# Altium schematic sheet ltk-mw-tx.SchDoc: MW Bench - Transmitter
size A3; DocumentNumber: 3; Revision: 3.0; SheetNumber: 3; SheetTotal: 3
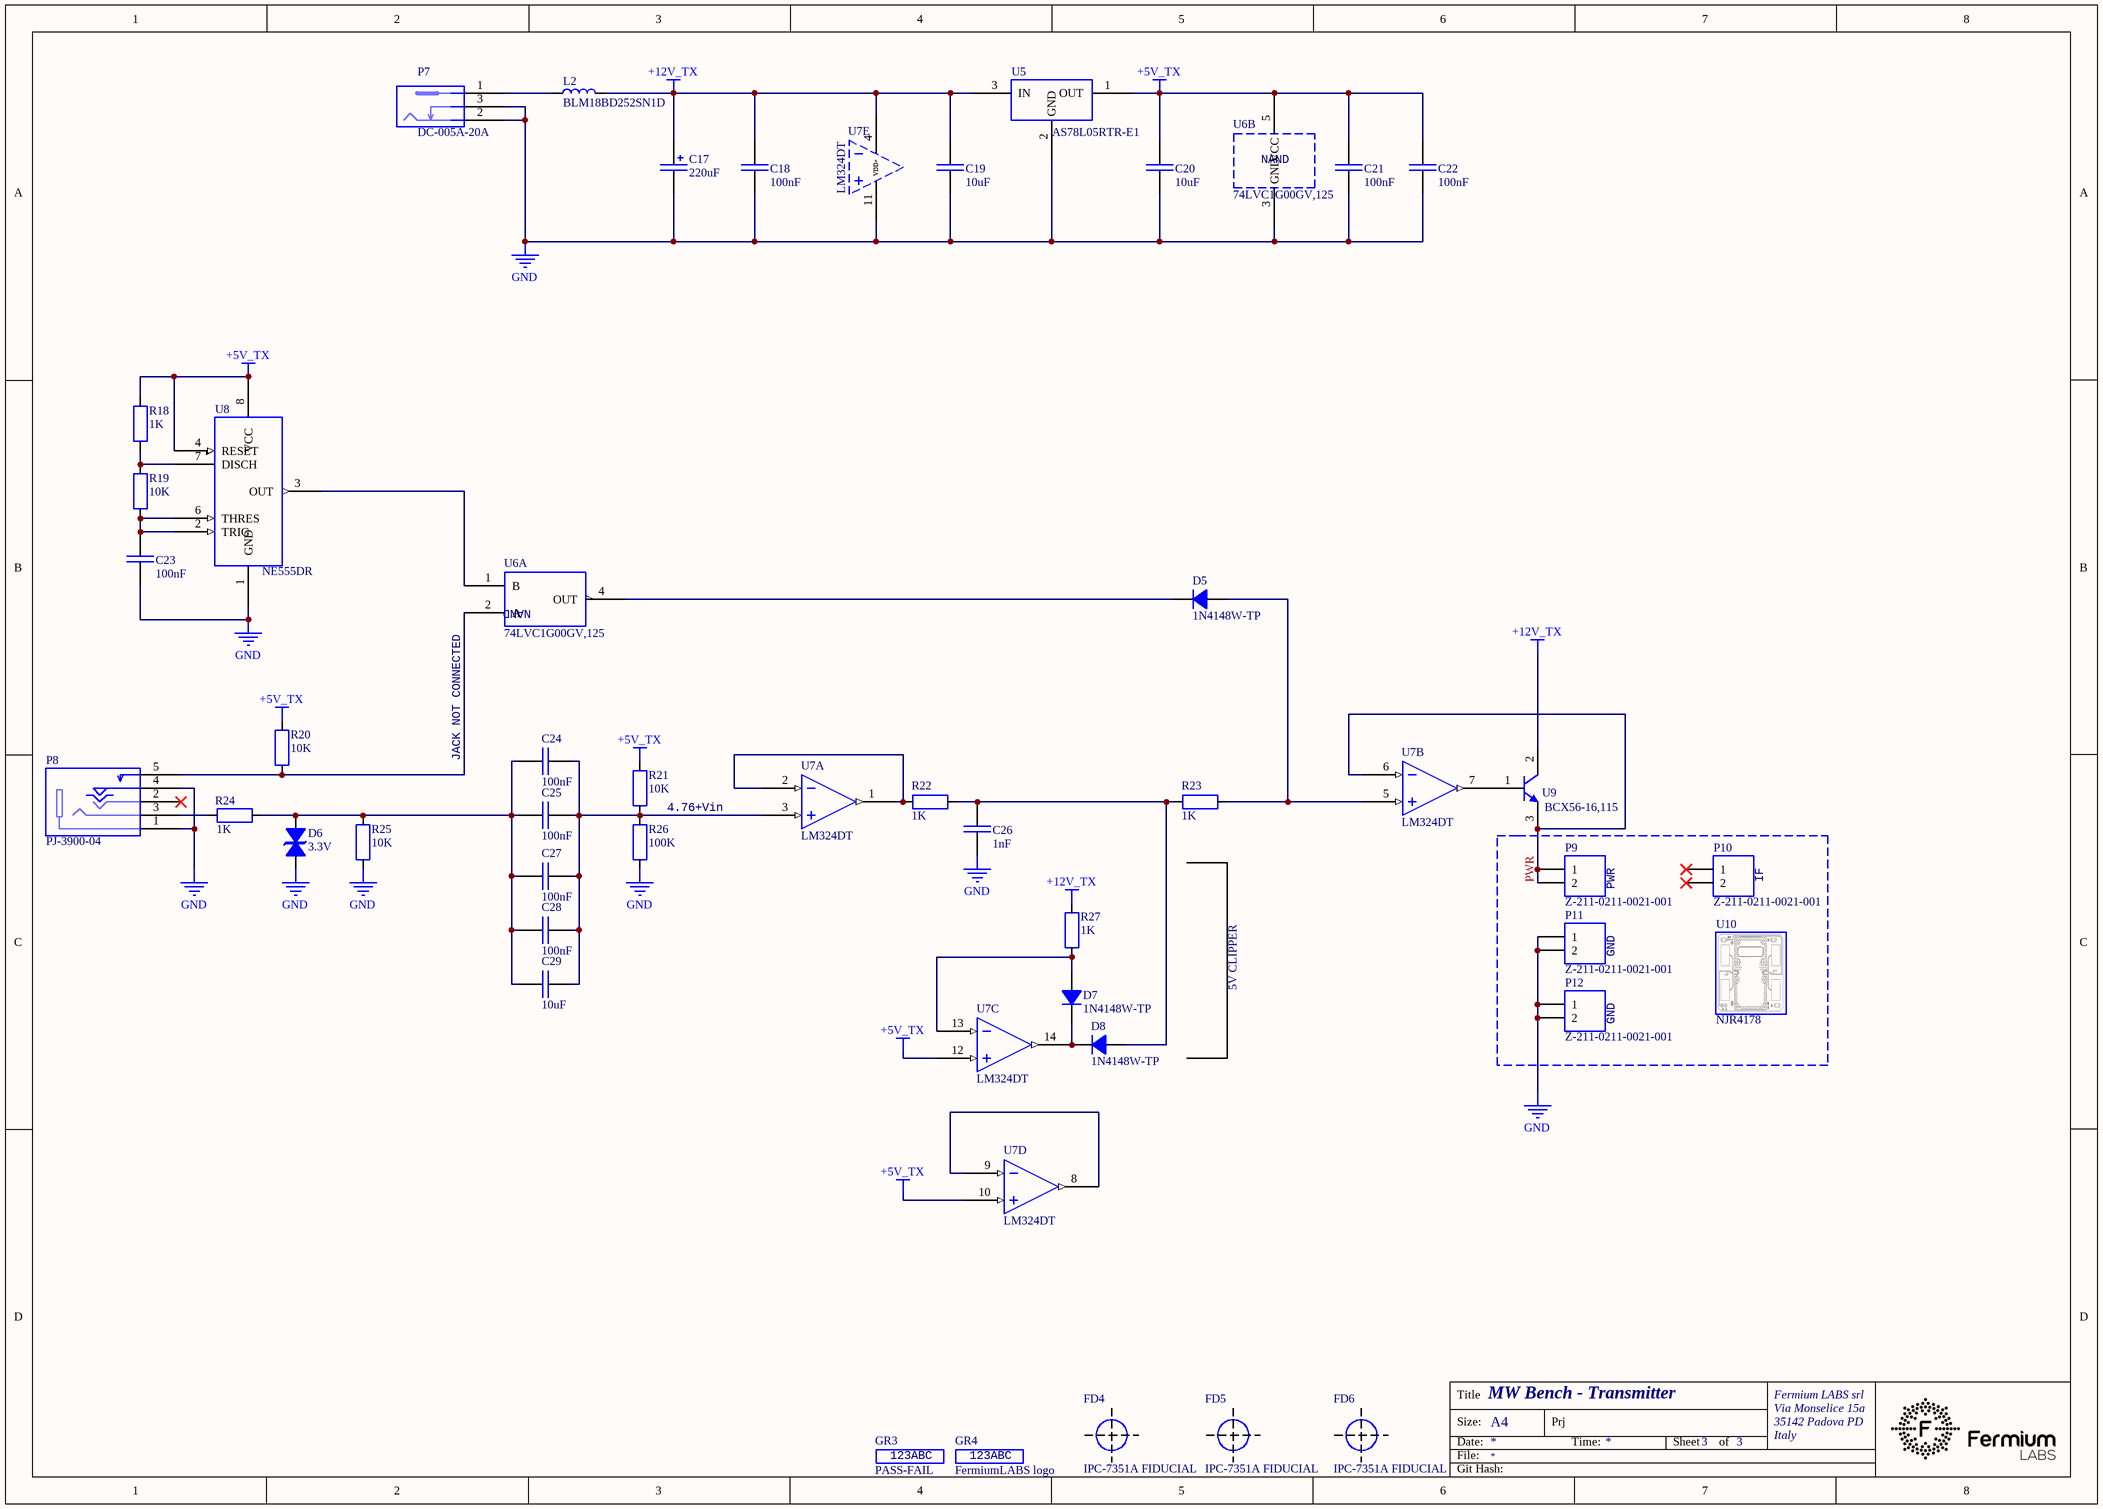
[diagram p0: ltk-mw-tx.SchDoc]

## Parts
C17  220uF  [3924B366-8672-45E9-B0BE-62DACC24E783]
C18  100nF  [CAP 0603_1608]
C19  10uF  [CAP 0805_2012]
C20  10uF  [CAP 0805_2012]
C21  100nF  [CAP 0603_1608]
C22  100nF  [CAP 0603_1608]
C23  100nF  [CAP 0603_1608]
C24  100nF  [CAP 0603_1608]
C25  100nF  [CAP 0603_1608]
C26  1nF  [CAP 0603_1608]
C27  100nF  [CAP 0603_1608]
C28  100nF  [CAP 0603_1608]
C29  10uF  [CAP 0805_2012]
D5  1N4148W-TP  [SOD-123]
D6  3.3V  [SOD523F]
D7  1N4148W-TP  [SOD-123]
D8  1N4148W-TP  [SOD-123]
FD4  IPC-7351A FIDUCIAL  [FIDUCIAL-IPC-7351A]  (no BOM)
FD5  IPC-7351A FIDUCIAL  [FIDUCIAL-IPC-7351A]  (no BOM)
FD6  IPC-7351A FIDUCIAL  [FIDUCIAL-IPC-7351A]  (no BOM)
GR3  PASS-FAIL  [0B1556B7-A534-4801-B57D-01EFA34B1205]  (no BOM)
GR4  FermiumLABS logo  [5394DE47-A0E8-4329-8464-7791B7C19310]  (no BOM)
L2  BLM18BD252SN1D  [FER 0603_1608]
P7  DC-005A-20A  [F0972D8A-C5C0-4A84-836D-A9666EE65C2D]
P8  PJ-3900-04  [7EF2B92C-0FC9-4C85-B662-5CEC65BFCCC4]
P9  Z-211-0211-0021-001  [0FBEB40D-2B6D-43C7-945F-A2D40A82B953]
P10  Z-211-0211-0021-001  [0FBEB40D-2B6D-43C7-945F-A2D40A82B953]
P11  Z-211-0211-0021-001  [0FBEB40D-2B6D-43C7-945F-A2D40A82B953]
P12  Z-211-0211-0021-001  [0FBEB40D-2B6D-43C7-945F-A2D40A82B953]
R18  1K  [RES 0603_1608]
R19  10K  [RES 0603_1608]
R20  10K  [RES 0603_1608]
R21  10K  [RES 0603_1608]
R22  1K  [RES 0603_1608]
R23  1K  [RES 0603_1608]
R24  1K  [RES 0603_1608]
R25  10K  [RES 0603_1608]
R26  100K  [RES 0603_1608]
R27  1K  [RES 0603_1608]
U5  AS78L05RTR-E1  [E733EFB9-FE91-4AE9-9197-29251971C3DC]
U6  74LVC1G00GV,125  [9B4F62E8-D129-4139-99C7-3E5580D0C4B3]  (parts A,B of 2)
U7  LM324DT  [34355DA5-B1DA-47C2-A88A-ECF82120A4F7]  (parts A,B,C,D,E of 5)
U8  NE555DR  [TI SOIC-8 D]
U9  BCX56-16,115  [13DB0D7C-893C-4A10-A75B-EAAEE46B398C]
U10  NJR4178  [25B19271-CD6F-4BC8-A99B-F617D566DC9C]

## Nets
+5V_TX: C20.2 C21.2 C22.2 R18.2 R20.1 R21.2 U5.1(OUT) U6.5(VCC) U7.10(IN+) U7.12(IN+) U8.4(RESET) U8.8(VCC)
+12V_TX: C17.1 C18.2 C19.2 L2.2 R27.2 U5.3(IN) U7.4(VDD+) U9.2(C)
GND: C17.2 C18.1 C19.1 C20.1 C21.1 C22.1 C23.2 C26.2 D6.2 P7.2 P7.3 P8.1(GND) P8.4(AUX) P11.1 P11.2 P12.1 P12.2 R25.1 R26.1 U5.2(GND) U6.3(GND) U7.11(VDD-) U8.1(GND)
PWR: P9.1 P9.2 U7.6(IN-) U9.3(E)
NetC23_1: C23.1 R19.1 U8.2(TRIG) U8.6(THRES)
NetC24_1: C24.1 C25.1 C27.1 C28.1 C29.1 D6.1 R24.1 R25.2
NetC24_2: C24.2 C25.2 C27.2 C28.2 C29.2 R21.1 R26.2 U7.3(IN+)
NetC26_1: C26.1 D8.2(A) R22.2 R23.1
NetD5_1: D5.1(K) U6.4(OUT)
NetD5_2: D5.2(A) R23.2 U7.5(IN+)
NetD7_1: D7.1(K) D8.1(K) U7.14(OUT)
NetD7_2: D7.2(A) R27.1 U7.13(IN-)
NetL2_1: L2.1 P7.1
NetP8_3: P8.3(L) R24.2
NetP8_5: P8.5(AUX) R20.2 U6.2(A)
NetR18_1: R18.1 R19.2 U8.7(DISCH)
NetR22_1: R22.1 U7.1(OUT) U7.2(IN-)
NetU6_1: U6.1(B) U8.3(OUT)
NetU7_7: U7.7(OUT) U9.1(B)
NetU7_8: U7.8(OUT) U7.9(IN-)

Not connected (* = marked no-connect by the designer): P8 2(R)*; P10 1* 2*

## Notes on the sheet
- JACK NOT CONNECTED
- 4.76+Vin
- PWR
- (near P10) IF
- 5V CLIPPER
- GND
- (near P12) GND
- Title
- Fermium LABS srl
- Size:
- Date:
- File:
- A4
- Prj
- Time:
- Sheet
- of
- Via Monselice 15a
- 35142 Padova PD
- Italy
- Git Hash:
- (in symbol 50f8ea88-0034-49fe-a263-d8e97bc35e2f) 123ABC
- (in symbol 33900555-dbb4-4b72-871f-952983a59b08, part A) NAND
- (in symbol 33900555-dbb4-4b72-871f-952983a59b08, part B) NAND
- (in symbol d1abe19f-3fed-4f20-b2ed-afc0ffbc6628) 123ABC

## Library data of the parts
C17 = 1a28df19-6d3e-4a71-836c-f22920f8e8ab: CAP  THT ELEC 220uF 25V 20%; Manufacturer 1: Rubycon; Manufacturer Part Number 1: 25PK220MEFC-6.3*11; id: 14782; S 1: LCSC; SPN 1: C109337; Part Number: 1a28df19-6d3e-4a71-836c-f22920f8e8ab; ComponentLink1Description: Datasheet; ComponentLink1URL: http://localhost:8080/static/files/Rubycon-220uF-25V_C109337_12019-03-10_214953.757848.pdf?Rubycon-220uF-25V_C109337 (1).pdf; Value: 220uF
C18 C21-C25 C27 C28 = 02841f84-ac15-41b5-9e17-915f8f067828: CAP SMD MLCC 100nF 25V 0603 X7R; Manufacturer 1: Samsung Electro-Mechanics; Manufacturer Part Number 1: CL10B104KA8NNNC; id: 14784; S 1: LCSC; SPN 1: C1590; Part Number: 02841f84-ac15-41b5-9e17-915f8f067828; ComponentLink1Description: Datasheet; ComponentLink1URL: http://localhost:8080/static/files/Samsung-Electro-Mechanics-CL10B104KA8NNNC_C15902019-03-10_215548.826887.pdf?Samsung-Electro-Mechanics-CL10B104KA8NNNC_C1590.pdf; Value: 100nF
C19 C20 C29 = 1ffbe5a9-0884-4740-bdad-20a6a98400e6: CAP SMD MLCC 10uF 25V 0805 X5R; Manufacturer 1: Samsung Electro-Mechanics; Manufacturer Part Number 1: CL21A106KAYNNNE; id: 14779; S 1: LCSC; SPN 1: C84416; SPN 2: C15850; Part Number: 1ffbe5a9-0884-4740-bdad-20a6a98400e6; ComponentLink1Description: Datasheet; ComponentLink1URL: http://localhost:8080/static/files/Samsung-Electro-Mechanics-CL21A106KAYNNNE_C158502019-03-10_213827.610739.pdf?Samsung-Electro-Mechanics-CL21A106KAYNNNE_C15850.pdf; Value: 10uF; Manufacturer 2: Murata; Manufacturer Part Number 2: GRM21BR61E106KA73L; S 2: LCSC
C26 = 0eca2548-3630-4fea-a3d5-94248c1cae74: CAP SMD MLCC 1nF 50V 0603 X7R; Manufacturer 1: Samsung Electro-Mechanics; Manufacturer Part Number 1: CL10B102KB8NNNC; id: 14785; S 1: LCSC; SPN 1: C1588; Part Number: 0eca2548-3630-4fea-a3d5-94248c1cae74; ComponentLink1Description: Datasheet; ComponentLink1URL: http://localhost:8080/static/files/Samsung-Electro-Mechanics-CL10B102KB8NNNC_C1588_12019-03-10_215732.131818.pdf?Samsung-Electro-Mechanics-CL10B102KB8NNNC_C1588 (1).pdf; Value: 1nF
D5 D7 D8 = 5e920700-75df-48e3-84dd-8f9f777caed8: DIODE SMD 100V 150mA 1.5Vf SOD-123 4148; Manufacturer 1: MCC; id: 14795; S 1: LCSC; SPN 1: C77978; Part Number: 5e920700-75df-48e3-84dd-8f9f777caed8; ComponentLink1Description: Datasheet; ComponentLink1URL: http://localhost:8080/static/files/Micro-Commercial-Components-MCC-1N4148W-TP_C779782019-04-06_215019.428643.pdf?Micro-Commercial-Components-MCC-1N4148W-TP_C77978.pdf; Manufacturer Part Number 1: 1N4148W-TP
D6 = d6266fd0-7428-4fb9-a062-338cdce926fd: DIODE SMD TVS 3.3V BIDIRECTIONAL SOD-523; Manufacturer 1: Born Semiconductor; Manufacturer Part Number 1: PESD3V3S1BA-N; id: 14798; S 1: LCSC; SPN 1: C85377; SPN 2: C316037; Part Number: d6266fd0-7428-4fb9-a062-338cdce926fd; ComponentLink1Description: Datasheet; ComponentLink1URL: http://localhost:8080/static/files/Bourne-Semicon-Shenzhen-PESD3V3S1BA-N_C3160372019-04-07_002431.794112.pdf?Bourne-Semicon-Shenzhen-PESD3V3S1BA-N_C316037.pdf; Value: 3.3V; ComponentLink2Description: Datasheet; ComponentLink2URL: http://localhost:8080/static/files/Nexperia-PESD3V3S1UB115-datasheet2019-08-16_201415.198759.pdf?Nexperia-PESD3V3S1UB,115-datasheet.pdf; Manufacturer 2: Nexperia; Manufacturer Part Number 2: PESD3V3S1UB,115; S 2: LCSC
FD4-FD6 = 19da4612-eb95-43bb-9984-553a52b2a224: GRAPHICS FIDUCIAL IPC-7351A; id: 14800; Part Number: 19da4612-eb95-43bb-9984-553a52b2a224
GR3 = d1abe19f-3fed-4f20-b2ed-afc0ffbc6628: GRAPHICS PASS-FAIL MARK; id: 14801; Part Number: d1abe19f-3fed-4f20-b2ed-afc0ffbc6628
GR4 = 50f8ea88-0034-49fe-a263-d8e97bc35e2f: GRAPHICS LOGO FERMIUM LABS SRL; id: 14799; Part Number: 50f8ea88-0034-49fe-a263-d8e97bc35e2f
L2 = c9e30ae8-9d5b-4135-a079-b1147da846d8: FER SMD CHIP 0603 400mA 1k@100MHz 500mOhm; Manufacturer 1: Murata; id: 14786; S 1: LCSC; SPN 1: C77668; Part Number: c9e30ae8-9d5b-4135-a079-b1147da846d8; ComponentLink1Description: Datasheet; ComponentLink1URL: http://localhost:8080/static/files/Murata-Electronics-BLM18AG102SN1D_C858242019-03-10_220021.186607.pdf?Murata-Electronics-BLM18AG102SN1D_C85824.pdf; Manufacturer Part Number 1: BLM18BD252SN1D
P7 = b53db51a-1725-412b-9039-fa7a45c7c438: CONN THT DC JACK 0.5A 30VDC 5Kcycles; Manufacturer 1: HRO Electronics; id: 14780; S 1: LCSC; SPN 1: C191049; Part Number: b53db51a-1725-412b-9039-fa7a45c7c438; ComponentLink1Description: Datasheet; ComponentLink1URL: http://localhost:8080/static/files/Korean-Hroparts-Elec-DC-005A-20A_C191049_22019-03-10_214231.486078.pdf?Korean-Hroparts-Elec-DC-005A-20A_C191049 (2).pdf; Manufacturer Part Number 1: DC-005A-20A
P8 = 80507a24-5d7c-4cf5-953e-f54832d54564: CONN THT 3.5mm AUDIO STEREO AUX SWITCH; Manufacturer 1: HRO Electronics; id: 14793; S 1: LCSC; SPN 1: C151839; Part Number: 80507a24-5d7c-4cf5-953e-f54832d54564; ComponentLink1Description: Datasheet; ComponentLink1URL: http://localhost:8080/static/files/Korean-Hroparts-Elec-PJ-3900-04_C1518392019-04-10_231144.687617.pdf?Korean-Hroparts-Elec-PJ-3900-04_C151839.pdf; Manufacturer Part Number 1: PJ-3900-04
P9-P12 = fb9043ef-1dd5-4a9c-8c1a-da0c667690ac: CONN THT PIN HEADER 2P MALE 2.54mm; Manufacturer 1: Nextronics Engineering; id: 14796; S 1: LCSC; SPN 1: C225477; SPN 2: C152154; SPN 3: C124375; Part Number: fb9043ef-1dd5-4a9c-8c1a-da0c667690ac; ComponentLink1Description: Datasheet; ComponentLink1URL: http://localhost:8080/static/files/Shenzhen-Cankemeng-Headers-Pins-1-2P-2-54mm-Straight-line_C1243752019-04-06_220043.339618.pdf?Shenzhen-Cankemeng-Headers-Pins-1-2P-2-54mm-Straight-line_C124375.pdf; ComponentLink2Description: Datasheet; ComponentLink2URL: http://localhost:8080/static/files/Nextronics-Engineering-Z-211-0211-0021-001_C1521542019-04-06_220050.159477.pdf?Nextronics-Engineering-Z-211-0211-0021-001_C152154.pdf; ComponentLink3Description: Datasheet; ComponentLink3URL: http://localhost:8080/static/files/Changjiang-Connectors-A2541WV-2P_C2254772019-04-06_220058.382973.pdf?Changjiang-Connectors-A2541WV-2P_C225477.pdf; Manufacturer 2: Changjiang Connectors; Manufacturer 3: Shenzhen Cankemeng; Manufacturer Part Number 1: Z-211-0211-0021-001; Manufacturer Part Number 2: A2541WV-2P; Manufacturer Part Number 3: ---; S 2: LCSC; S 3: LCSC
R18 R22-R24 R27 = a678220f-9e9d-4863-a833-9993504f723c: RES SMD 1K OHM 1% 1/10W 0603; Manufacturer 1: Yageo; Manufacturer Part Number 1: RC0603FR-071KL; id: 14794; S 1: LCSC; SPN 1: C22548; Part Number: a678220f-9e9d-4863-a833-9993504f723c; Value: 1K
R19-R21 R25 = 93242766-ba1d-462d-b58f-ce1dfc4129c8: RES SMD 10K OHM 1% 1/10W 0603; Manufacturer 1: Yageo; Manufacturer Part Number 1: RC0603FR-0710KL; id: 12101; S 1: LCSC; SPN 1: C98220; Part Number: 93242766-ba1d-462d-b58f-ce1dfc4129c8; Value: 10K
R26 = 76af10b3-9d85-4b5c-a2d6-26cc74f432f7: RES SMD 100K OHM 1% 1/10W 0603; Manufacturer 1: Yageo; Manufacturer Part Number 1: RC0603FR-07100KL; id: 12746; S 1: LCSC; SPN 1: C14675; Part Number: 76af10b3-9d85-4b5c-a2d6-26cc74f432f7; Value: 100K
U5 = fd64863e-487f-4688-b264-696c0ba5456b: IC SMD LINEAR VOLTAGE REGULATOR 5V 100mA SOT-89; Manufacturer 1: Diodes Inc.; id: 14783; S 1: LCSC; SPN 1: C90471; SPN 2: C90763; Part Number: fd64863e-487f-4688-b264-696c0ba5456b; ComponentLink1Description: Datasheet; ComponentLink1URL: http://localhost:8080/static/files/Diodes-Incorporated-AS78L05RTR-E1_C90471_12019-03-10_215252.941962.pdf?Diodes-Incorporated-AS78L05RTR-E1_C90471 (1).pdf; ComponentLink2Description: Datasheet; ComponentLink2URL: http://localhost:8080/static/files/KIA-Semicon-Tech-KIA78L05T_C90763_12019-03-10_215415.523371.pdf?KIA-Semicon-Tech-KIA78L05T_C90763 (1).pdf; Manufacturer 2: KIA Semicon Tech; Manufacturer Part Number 1: AS78L05RTR-E1; Manufacturer Part Number 2: KIA78L05T; S 2: LCSC
U6 = 33900555-dbb4-4b72-871f-952983a59b08: IC SMD NAND GATE 2 INPUTS 74X00 SC-74A; Manufacturer 1: Nexperia; id: 14797; S 1: LCSC; SPN 1: C131308; Part Number: 33900555-dbb4-4b72-871f-952983a59b08; ComponentLink1Description: Datasheet; ComponentLink1URL: http://localhost:8080/static/files/Nexperia-74LVC1G00GV-125_C1313082019-04-06_222642.812294.pdf?Nexperia-74LVC1G00GV-125_C131308.pdf; Manufacturer Part Number 1: 74LVC1G00GV,125
U7 = 21a85167-c328-42f7-a52e-365842c6dad3: IC SMD OPAMP LM324DT SO-14; Manufacturer 1: ST Microelectronics; id: 14792; S 1: LCSC; SPN 1: C71035; Part Number: 21a85167-c328-42f7-a52e-365842c6dad3; ComponentLink1Description: Datasheet; ComponentLink1URL: http://localhost:8080/static/files/STMicroelectronics-LM324DT_C710352019-04-06_191500.254110.pdf?STMicroelectronics-LM324DT_C71035.pdf; Manufacturer Part Number 1: LM324DT
U8 = d16ab88a-2543-469a-8940-7b800b633548: IC SMD TIMER NE555 SOIC-8; Manufacturer 1: Texas Instruments; id: 14787; S 1: LCSC; SPN 1: C7593; Part Number: d16ab88a-2543-469a-8940-7b800b633548; ComponentLink1Description: Datasheet; ComponentLink1URL: http://localhost:8080/static/files/Texas-Instruments-TI-NE555DR_C7593_22019-03-10_221020.033506.pdf?Texas-Instruments-TI-NE555DR_C7593 (2).pdf; Manufacturer Part Number 1: NE555DR
U9 = 0e502e05-00ae-4c6f-83a4-b2f55de2403a: TRANS NPN BCX56-16 1A 80V 1.25W SOT-89-3; Manufacturer 1: Nexperia; id: 14824; Part Number: 0e502e05-00ae-4c6f-83a4-b2f55de2403a; ComponentLink1Description: Datasheet; ComponentLink1URL: http://localhost:8080/static/files/Nexperia-BCX56-16-115_C1000262019-07-12_120358.7389322019-07-15_223409.342685.pdf?Nexperia-BCX56-16-115_C1000262019-07-12_120358.738932.pdf; Manufacturer Part Number 1: BCX56-16,115
U10 = f0e19a38-18de-4253-8da2-aebb0c4083bd: MODULE THT RADAR DOPPLER 10.525GHz NJR4178; Manufacturer 1: New Japan Radio; id: 14789; S 1: CONSYSTEM srl (Italy); SPN 1: JM417800-LF; Part Number: f0e19a38-18de-4253-8da2-aebb0c4083bd; ComponentLink1Description: Datasheet; ComponentLink1URL: http://localhost:8080/static/files/Xdoppler_NJR41767881_rev032019-03-10_230533.619662.pdf?Xdoppler_NJR4176^78^81_rev03.pdf; ComponentLink2Description: Corrispondence; ComponentLink2URL: http://localhost:8080/static/files/FERMIUM_LABS_Moduli_NJR41782019-03-10_230730.901712.pdf?FERMIUM LABS  Moduli NJR4178.pdf; ComponentLink3Description: Quote; ComponentLink3URL: http://localhost:8080/static/files/201812111056099982019-03-10_230743.103809.pdf?20181211105609998.pdf; ComponentLink4Description: Product Page; ComponentLink4URL: https://micro.njr.com/eng/products/sensor/doppler/r4178.html; Manufacturer Part Number 1: NJR4178